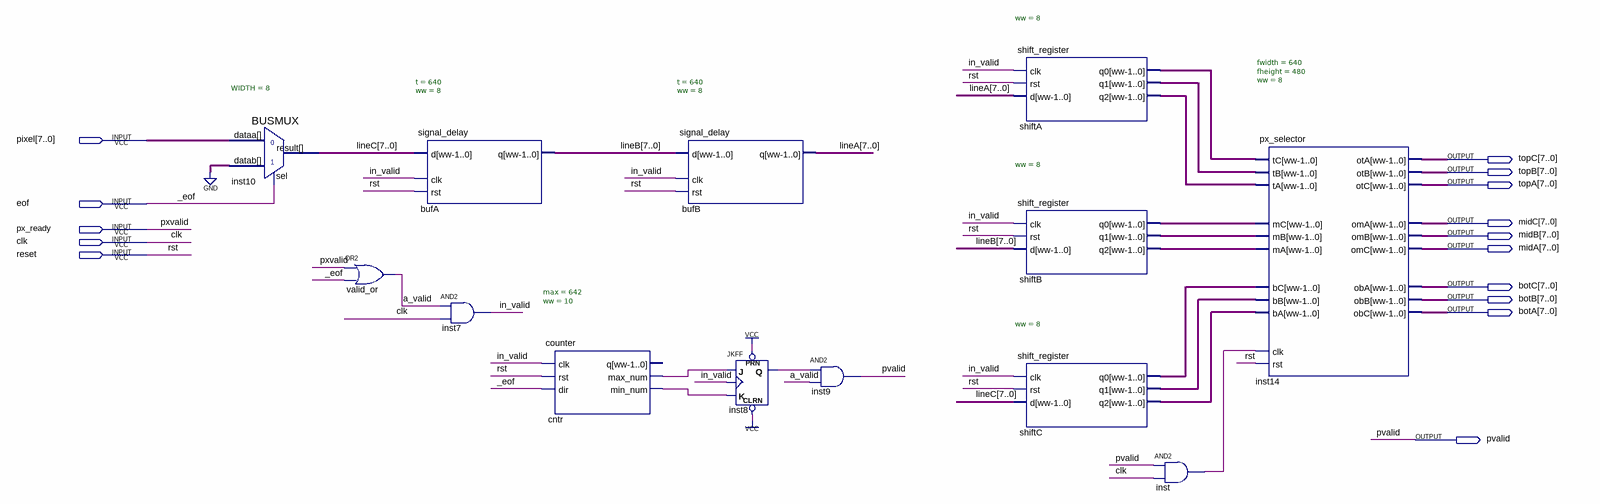
[diagram p0: schematic sheet]
// Quartus schematic pixel_buffering.bdf as structural Verilog: 13 symbols, 15 pins
module pixel_buffering (
  input  [7:0] pixel,
  input  eof,
  input  px_ready,
  input  clk,
  input  reset,
  output [7:0] topC,
  output [7:0] topB,
  output [7:0] topA,
  output [7:0] midC,
  output [7:0] midB,
  output [7:0] midA,
  output [7:0] botC,
  output [7:0] botB,
  output [7:0] botA,
  output pvalid
);

  wire a_valid, cntr_max_num, cntr_min_num, in_valid, inst8_q, inst_out;
  wire [7:0] lineA, lineB, lineC, shiftA_q0, shiftA_q1, shiftA_q2, shiftB_q0, shiftB_q1, shiftB_q2,
       shiftC_q0, shiftC_q1, shiftC_q2;

  BUSMUX #(.WIDTH(8)) inst10 (.datab({8{1'b0}}), .sel(eof), .dataa(pixel), .result(lineC));
  or valid_or (a_valid, px_ready, eof);
  signal_delay #(.t(640), .ww(8)) bufA (.clk(in_valid), .rst(reset), .d(lineC), .q(lineB));
  and inst7 (in_valid, a_valid, clk);
  counter #(.max(642), .ww(10)) cntr (
    .clk(in_valid), .rst(reset), .dir(eof), .max_num(cntr_max_num), .min_num(cntr_min_num));  // open: q
  signal_delay #(.t(640), .ww(8)) bufB (.clk(in_valid), .rst(reset), .d(lineB), .q(lineA));
  JKFF inst8 (.PRN(1'b1), .CLRN(1'b1), .K(cntr_min_num), .J(cntr_max_num), .CLK(in_valid), .Q(inst8_q));
  and inst9 (pvalid, inst8_q, a_valid);
  shift_register #(.ww(8)) shiftA (
    .clk(in_valid), .rst(reset), .d(lineA), .q0(shiftA_q0), .q1(shiftA_q1), .q2(shiftA_q2));
  shift_register #(.ww(8)) shiftB (
    .clk(in_valid), .rst(reset), .d(lineB), .q0(shiftB_q0), .q1(shiftB_q1), .q2(shiftB_q2));
  shift_register #(.ww(8)) shiftC (
    .clk(in_valid), .rst(reset), .d(lineC), .q0(shiftC_q0), .q1(shiftC_q1), .q2(shiftC_q2));
  and inst (inst_out, pvalid, clk);
  px_selector #(.fwidth(640), .fheight(480), .ww(8)) inst14 (
    .clk(inst_out), .rst(reset), .tA(shiftA_q2), .tB(shiftA_q1), .tC(shiftA_q0), .mA(shiftB_q2),
    .mB(shiftB_q1), .mC(shiftB_q0), .bA(shiftC_q2), .bB(shiftC_q1), .bC(shiftC_q0), .otA(topC), .otB(topB),
    .otC(topA), .omA(midC), .omB(midB), .omC(midA), .obA(botC), .obB(botB), .obC(botA));

  // Other names for the same wires on the sheet: _eof = eof; pxvalid = px_ready; rst = reset
endmodule
